# EAGLE design hbridge1 (EAGLE 7.1.0)
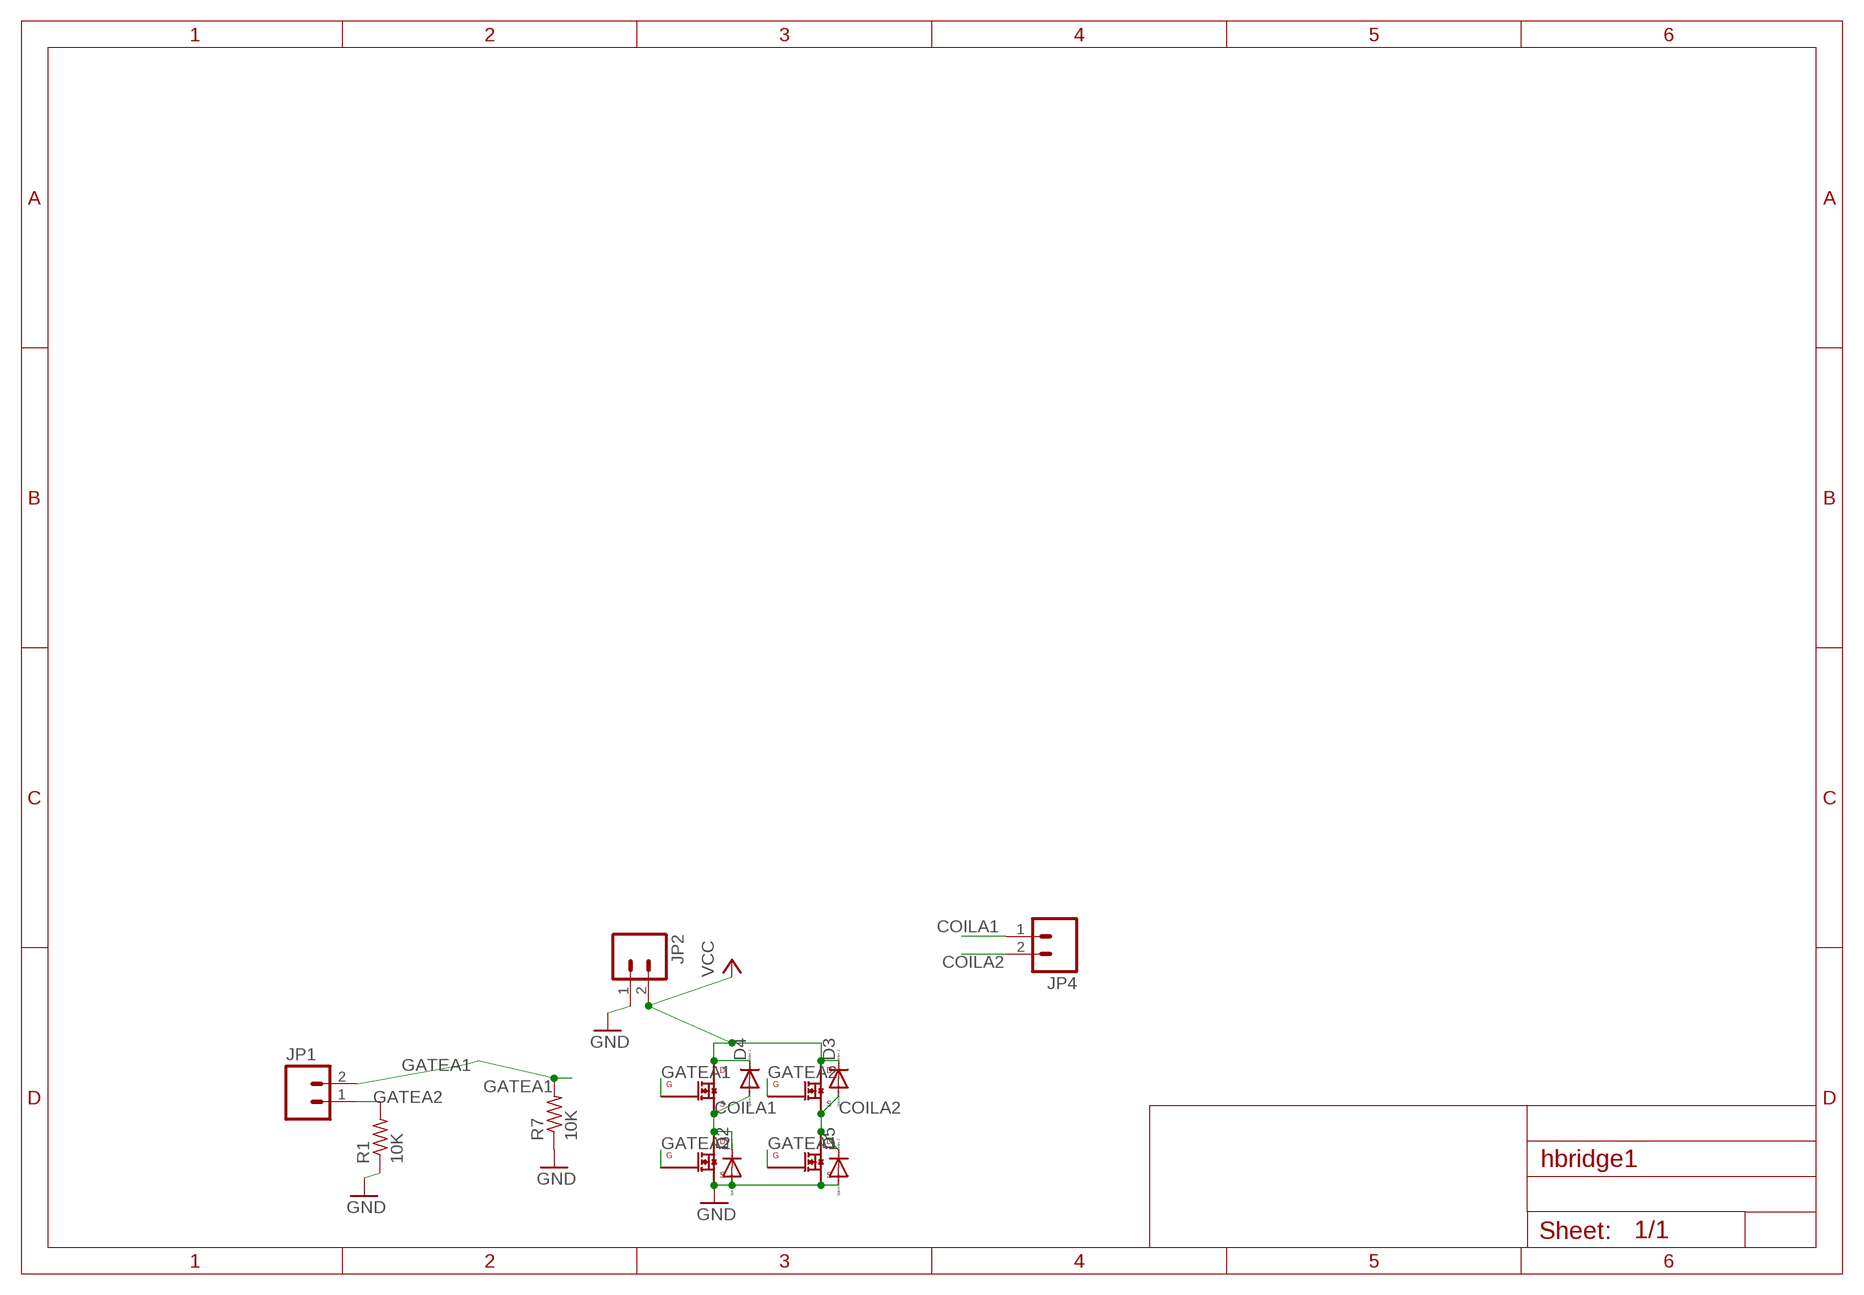
[diagram p0: schematic, sheet 1]

## Parts
D2  DIODE-DO-214AC  [DO-214AC]
D3  DIODE-DO-214AC  [DO-214AC]
D4  DIODE-DO-214AC  [DO-214AC]
D5  DIODE-DO-214AC  [DO-214AC]
JP1  M02PTH  [1X02]
JP2  M02PTH  [1X02]
JP4  M02PTH  [1X02]
Q2  IRLML0060  [SOT-23]
Q3  IRLML0060  [SOT-23]
Q4  IRLML0060  [SOT-23]
Q5  IRLML0060  [SOT-23]
R1  10K  R-US_R0603  [R0603]
R7  10K  R-US_R0603  [R0603]

## Nets
COILA1: D2.C D4.A JP4.1 Q2.3(DRAIN) Q4.2(SOURCE)
COILA2: D3.A D5.C JP4.2 Q3.2(SOURCE) Q5.3(DRAIN)
GATEA1: JP1.2 Q4.1(GATE) Q5.1(GATE) R7.2
GATEA2: JP1.1 Q2.1(GATE) Q3.1(GATE) R1.2
GND: D2.A D5.A JP2.1 Q2.2(SOURCE) Q5.2(SOURCE) R1.1 R7.1
VCC: D3.C D4.C JP2.2 Q3.3(DRAIN) Q4.3(DRAIN)

## Library data of the parts
D2-D5 = diode:DIODE-: DIODE
JP1 JP2 JP4 = SparkFun-Connectors:M02: Standard 2-pin 0.1" header. Use with - straight break away headers ( PRT-00116) - right angle break away headers (PRT-00553) - swiss pins (PRT-00743) - machine pins (PRT-00117) - female headers (PRT-00115) Molex polarized connector foot print use with: PRT-08233 with associated crimp pins and housings. 2.54_SCREWTERM for use with PRT-10571. 3.5mm Screw Terminal footprints for PRT-08084 5mm Screw Terminal footprints for use with PRT-08432
Q2-Q5 = spietz-library:IRLML0060
R1 R7 = resistor:R-US_: RESISTOR, American symbol

## Net classes
0 default: width 0.203 mm
1 vcc: width 0.254 mm

## Board
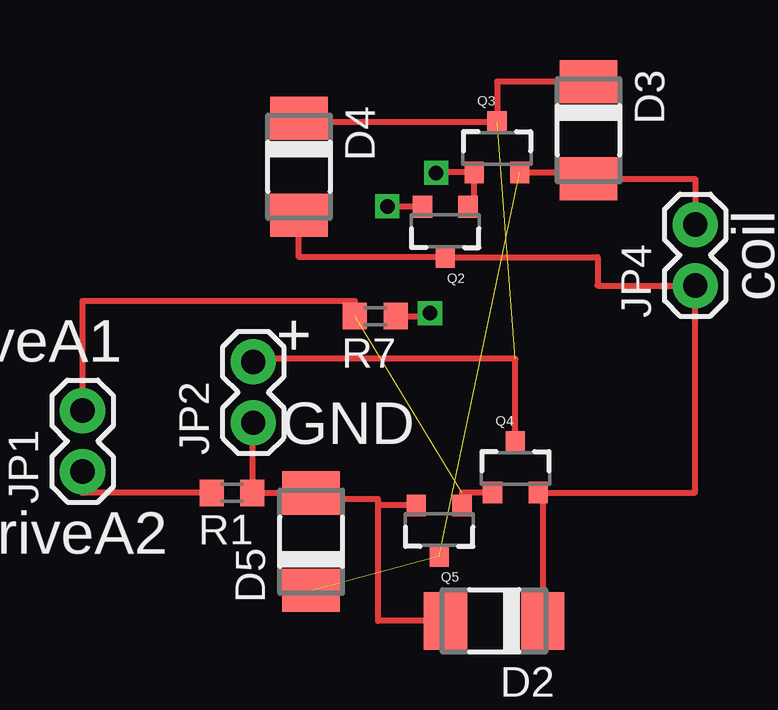
[diagram p1: board, top side]
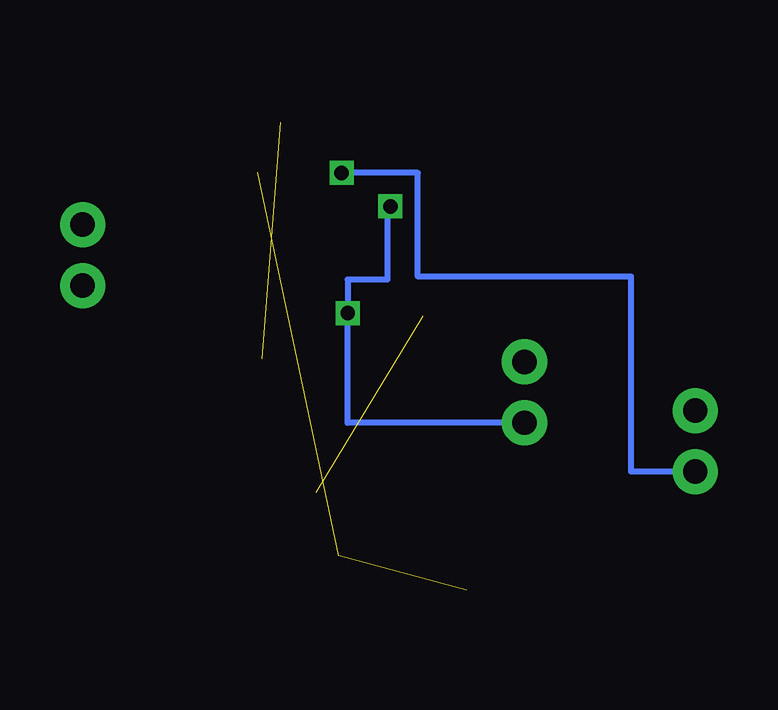
[diagram p2: board, bottom side, seen from below]

No outline drawn. Coordinates in mm, seen from the top.
Copper layers (1*16): Top 0.035mm / dielectric 1.5mm / Bottom 0.035mm
Design rules "default": minimum track width 10mil, minimum drill 24mil, track to track 8mil, track to pad 8mil, pad to pad 8mil, via to via 8mil, smd to smd 8mil, copper to edge 40mil, drill to drill 8mil, minimum pad ring 10mil, minimum via ring 8mil, stop-mask expansion 4mil, vias tented up to drill 0mil, thermal gap 10mil

### Footprints (pad centres in the part's own frame; a part is rotated, then mirrored left to right if it is on the bottom)
DO-214AC = smd 1.8 x 2.4: A 2.025,0; C -2.025,0
1X02 = drill 1.016 pad 1.88: 1 0,0; 2 2.54,0
SOT-23 = smd 0.8 x 0.9: 1 -0.95,-1; 2 0.95,-1; 3 0,1.1
R0603 = smd 1 x 1.1: 1 -0.85,0; 2 0.85,0

### Placement (x,y rotation side)
D2  71.88,16.51 180 top
D3  75.82,36.96 270 top
D4  63.75,35.43 270 top
D5  64.26,19.81 90 top
JP1  54.74,22.73 90 top
JP2  61.85,24.77 90 top
JP4  80.26,30.48 90 top
Q2  69.85,32.77 180 top
Q3  72.01,36.2 0 top
Q4  72.77,22.86 0 top
Q5  69.6,20.32 180 top
R1  60.96,21.84 180 top
R7  66.93,29.21 180 top

### Tracks (layer width: path | path; a pad name or v marks a point on that pad's centre or on a via)
COILA1
  Top 0.254: D2.C 73.91,21.86 Q4.2 80.26,21.86 JP4.1 76.2,30.48 76.2,31.67 Q2.3 63.75,31.67 D4.A
COILA2  (2 unrouted)
  Top 0.254: Q3.2 75.82,35.2 D3.A 80.26,34.93 JP4.2
GATEA1  (1 unrouted)
  Top 0.254: Q4.1 70.55,21.86 Q5.1 | JP1.2 54.74,29.84 66.08,29.84 R7.2
GATEA2  (via drill 0.6)
  Top 0.254: Q2.1 71.06,33.77 Q3.1 69.47,35.2 v69.47,35.18 | R1.2 54.74,21.84 JP1.1
  Bottom 0.254: JP1.1 57.4,22.73 57.4,30.86 66.29,30.86 66.29,35.18 v69.47,35.18
GND  (via drill 0.6)
  Top 0.254: D2.A 67.06,16.51 67.06,21.32 | Q5.2 67.06,21.32 | 67.06,21.32 67.06,21.59 64.26,21.59 D5.A R1.1 61.81,24.77 JP2.1 | R7.1 69.22,29.21 v69.22,29.34 | Q2.2 67.44,33.77 v67.44,33.78
  Bottom 0.254: JP2.1 69.22,24.77 v69.22,29.34 69.22,30.73 67.56,30.73 67.56,33.78 v67.44,33.78
VCC  (1 unrouted)
  Top 0.254: D3.C 72.01,38.98 Q3.3 63.75,37.3 D4.C | Q4.3 72.77,27.43 61.85,27.43 JP2.2

### Text on the board
tPlace: coil | + | driveA1 | GND | driveA2